# EAGLE schematic Two_stage_amp (EAGLE 9.6.2)
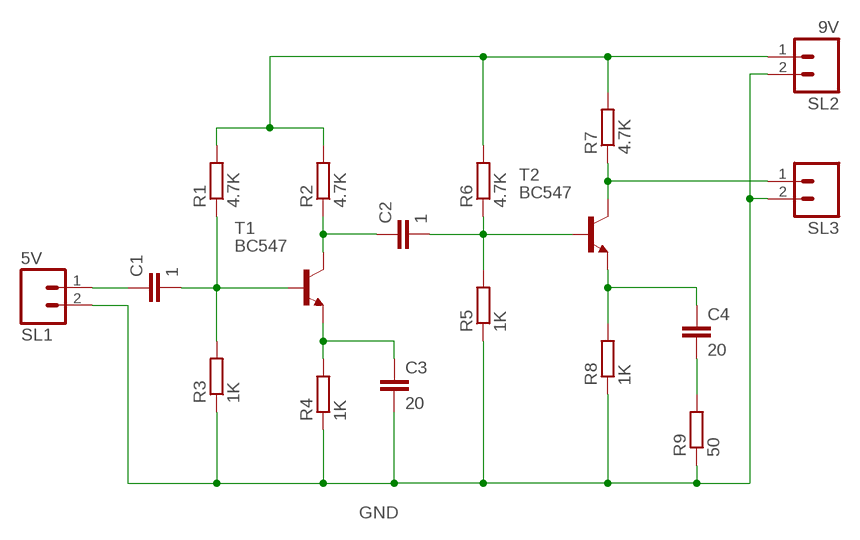
[diagram p0: schematic, sheet 1]

## Parts
C1  1  C-EU025-025X050  [C025-025X050]
C2  1  C-EU025-025X050  [C025-025X050]
C3  20  C-EU025-025X050  [C025-025X050]
C4  20  C-EU025-025X050  [C025-025X050]
R1  4.7K  R-EU_0204/7  [0204/7]
R2  4.7K  R-EU_0204/7  [0204/7]
R3  1K  R-EU_0204/7  [0204/7]
R4  1K  R-EU_0204/7  [0204/7]
R5  1K  R-EU_0204/7  [0204/7]
R6  4.7K  R-EU_0204/7  [0204/7]
R7  4.7K  R-EU_0204/7  [0204/7]
R8  1K  R-EU_0204/7  [0204/7]
R9  50  R-EU_0204/7  [0204/7]
SL1  5V  M02  [02P]
SL2  9V  M02  [02P]
SL3  M02  [02P]
T1  BC547  [TO92]
T2  BC547  [TO92]

## Nets
GND: C3.2 R3.1 R4.1 R5.1 R8.1 R9.1 SL1.2 SL2.2 SL3.2
N$1: C1.2 R1.1 R3.2 T1.2(B)
N$2: C2.1 R2.1 T1.3(C)
N$3: C1.1 SL1.1
N$4: C2.2 R5.2 R6.1 T2.2(B)
N$5: R1.2 R2.2 R6.2 R7.2 SL2.1
N$6: R7.1 SL3.1 T2.3(C)
N$7: C4.1 R8.2 T2.1(E)
N$8: C3.1 R4.2 T1.1(E)
N$15: C4.2 R9.2

## Library data of the parts
C1-C4 = rcl:C-EU: CAPACITOR, European symbol; SPICEPREFIX: C
R1-R9 = rcl:R-EU_: RESISTOR, European symbol; SPICEPREFIX: R
SL1-SL3 = con-amp-quick:M02: AMP QUICK CONNECTOR; OC_FARNELL: unknown; OC_NEWARK: unknown
T1 T2 = transistor:BC547: NPN TRANSISTOR